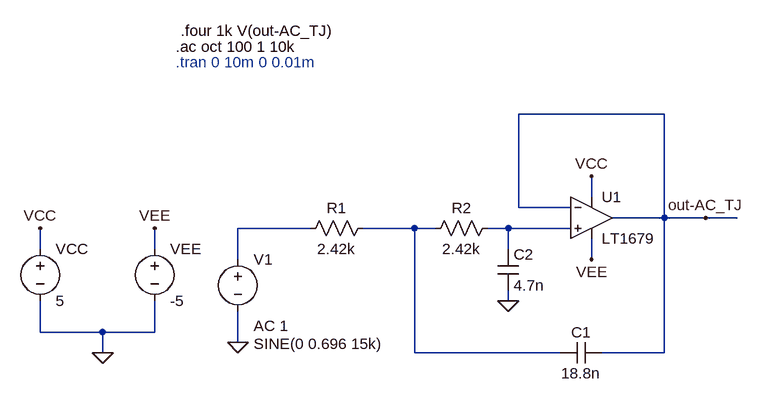
[diagram p0: schematic Etaj_2_Filtru_Sallen_Key.asc]
Etaj_2_Filtru_Sallen_Key.asc, the LTspice schematic file:
Version 4.1
SHEET 1 2236 1120
WIRE 2096 -352 1872 -352
WIRE 1984 -224 1984 -256
WIRE 1872 -208 1872 -352
WIRE 1952 -208 1872 -208
WIRE 2096 -192 2096 -352
WIRE 2096 -192 2016 -192
WIRE 2160 -192 2096 -192
WIRE 2208 -192 2160 -192
WIRE 1552 -176 1440 -176
WIRE 1712 -176 1632 -176
WIRE 1744 -176 1712 -176
WIRE 1856 -176 1824 -176
WIRE 1952 -176 1856 -176
WIRE 1136 -144 1136 -176
WIRE 1312 -144 1312 -176
WIRE 1856 -144 1856 -176
WIRE 1440 -128 1440 -176
WIRE 1984 -128 1984 -160
WIRE 1856 -64 1856 -80
WIRE 1136 -16 1136 -64
WIRE 1232 -16 1136 -16
WIRE 1312 -16 1312 -64
WIRE 1312 -16 1232 -16
WIRE 1440 0 1440 -48
WIRE 1232 16 1232 -16
WIRE 1712 16 1712 -176
WIRE 1936 16 1712 16
WIRE 2096 16 2096 -192
WIRE 2096 16 2000 16
FLAG 1984 -128 VEE
FLAG 1984 -256 VCC
FLAG 1232 16 0
FLAG 1136 -176 VCC
FLAG 1312 -176 VEE
FLAG 1440 0 0
FLAG 2160 -192 out-AC_TJ
FLAG 1856 -64 0
SYMBOL voltage 1136 -160 R0
WINDOW 123 0 0 Left 2
WINDOW 39 0 0 Left 2
SYMATTR InstName VCC
SYMATTR Value 5
SYMBOL voltage 1312 -160 R0
WINDOW 123 0 0 Left 2
WINDOW 39 0 0 Left 2
SYMATTR InstName VEE
SYMATTR Value -5
SYMBOL voltage 1440 -144 R0
WINDOW 123 24 118 Left 2
WINDOW 39 0 0 Left 2
WINDOW 3 24 146 Left 2
SYMATTR Value2 AC 1
SYMATTR Value SINE(0 0.696 15k)
SYMATTR InstName V1
SYMBOL res 1648 -192 R90
WINDOW 0 0 56 VBottom 2
WINDOW 3 32 56 VTop 2
SYMATTR InstName R1
SYMATTR Value 2.42k
SYMBOL res 1840 -192 R90
WINDOW 0 0 56 VBottom 2
WINDOW 3 32 56 VTop 2
SYMATTR InstName R2
SYMATTR Value 2.42k
SYMBOL cap 1840 -144 R0
SYMATTR InstName C2
SYMATTR Value 4.7n
SYMBOL cap 2000 0 R90
WINDOW 0 0 32 VBottom 2
WINDOW 3 32 32 VTop 2
SYMATTR InstName C1
SYMATTR Value 18.8n
SYMBOL OpAmps\\LT1679 1984 -192 R0
SYMATTR InstName U1
TEXT 1344 -456 Left 2 !.ac oct 100 1 10k
TEXT 1344 -432 Left 2 ;.tran 0 10m 0 0.01m
TEXT 1352 -480 Left 2 !.four 1k V(out-AC_TJ)

The netlist it stands for:
* Etaj_2_Filtru_Sallen_Key.asc
VCC VCC 0 5
VEE VEE 0 -5
V1 N001 0 SINE(0 0.696 15k) AC 1
R1 N002 N001 2.42k
R2 N003 N002 2.42k
C2 N003 0 4.7n
C1 out-AC_TJ N002 18.8n
* U1: LT1679 (symbol OpAmps\LT1679 not available, pins judged from their places): In+=N003 In-=out-AC_TJ V+=VCC V-=VEE OUT=out-AC_TJ
.ac oct 100 1 10k
* .tran 0 10m 0 0.01m
.four 1k V(out-AC_TJ)
.backanno
.end